# Altium schematic sheet Paddle_2.SchDoc: Paddle 2
size A4
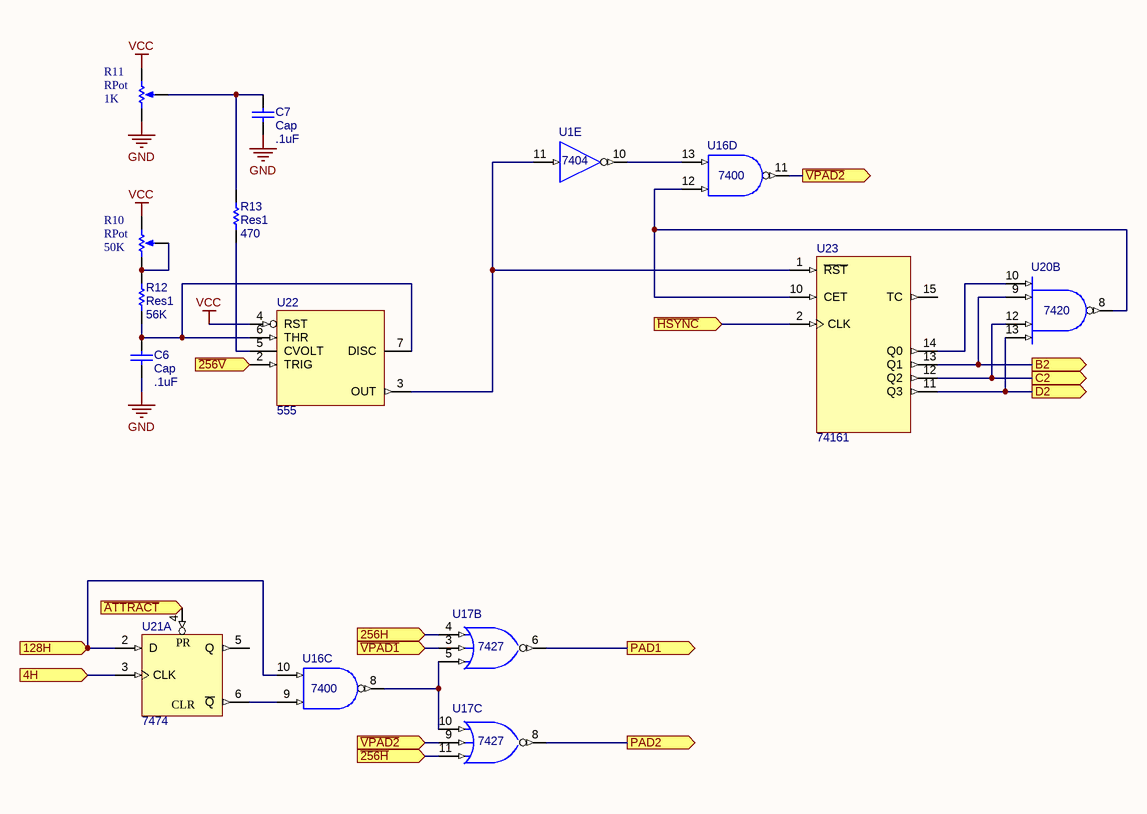
[diagram p0: Paddle_2.SchDoc]

## Parts
C6  Cap  value .1uF  [CAPR10.16-11.5x3.6]
C7  Cap  value .1uF  [CAPR10.16-11.5x3.6]
R10  RPot  value 50K  [TRIMPOT_THT_PV36X]
R11  RPot  value 1K  [VR5]
R12  Res1  value 56K  [AXIAL-0.4]
R13  Res1  value 470  [AXIAL-0.4]
U1  7404  [N014]  (part E of 6)
U16  7400  [N014]  (parts C,D of 4)
U17  7427  [N014]  (parts B,C of 3)
U20  7420  [N014]  (part B of 2)
U21  7474  [N014D]  (part A of 2)
U22  555  [P008]
U23  74161  [N016]

## Ports
4H, 128H, 256H, B2, C2, D2, PAD1, PAD2, ~{256H}, ~{256V}, ~{ATTRACT}, ~{HSYNC}, ~{VPAD1}, ~{VPAD2}

## Nets
GND: C6.1 C7.1 R11.1(TOP) U1.7(GND) U16.7(GND) U17.7(GND) U20.7(GND) U21.7(GND) U22.1(GND) U23.8(GND)
VCC: R10.CW(BOT) R11.2(BOT) U1.14(VCC) U16.14(VCC) U17.14(VCC) U20.14(VCC) U21.1(CLR) U21.14(VCC) U22.4(RST) U22.8(VCC) U23.3(P0) U23.4(P1) U23.5(P2) U23.6(P3) U23.7(CEP) U23.9(~{PE}) U23.16(VCC)
4H: U21.3(CLK) ; port 4H
128H: U16.10(B) U21.2(D) ; port 128H
256H: U17.4(B) ; port 256H
~{256H}: U17.11(C) ; port ~{256H}
~{256V}: U22.2(TRIG) ; port ~{256V}
~{ATTRACT}: U21.4(PR) ; port ~{ATTRACT}
~{HSYNC}: U23.2(CLK) ; port ~{HSYNC}
~{VPAD1}: U17.3(A) ; port ~{VPAD1}
~{VPAD2}: U16.11(Y) U17.9(A) ; port ~{VPAD2}
B2: U20.9(A) U23.13(Q1) ; port B2
C2: U20.12(C) U23.12(Q2) ; port C2
D2: U20.13(D) U23.11(Q3) ; port D2
PAD1: U17.6(Y) ; port PAD1
PAD2: U17.8(Y) ; port PAD2
NetC6_2: C6.2 R12.1 U22.6(THR) U22.7(DISC)
NetC7_2: C7.2 R11.3(TAP) R13.2
NetR10_CCW: R10.CCW(TOP) R10.W(TAP) R12.2
NetR13_1: R13.1 U22.5(CVOLT)
NetU1_10: U1.10(Y) U16.13(B)
NetU1_11: U1.11(A) U22.3(OUT) U23.1(~{RST})
NetU16_8: U16.8(Y) U17.5(C) U17.10(B)
NetU16_9: U16.9(A) U21.6(~{Q})
NetU16_12: U16.12(A) U20.8(Y) U23.10(CET)
NetU20_10: U20.10(B) U23.14(Q0)

Not connected (* = marked no-connect by the designer): U21 5(Q); U23 15(TC)

## Notes on the sheet
- Text
- Page
- PONG

## Library data of the parts
C6 C7 = Cap: Capacitor; Published: 8-Jun-2000; LatestRevisionDate: 17-Jul-2002; LatestRevisionNote: Re-released for DXP Platform.; PackageReference: RAD-0.3; Publisher: Altium Limited; PackageDescription: Radial Cap, Thru-Hole; 2 Leads; 0.3 in Pin Spacing
R10 R11 = RPot: Potentiometer; Sim Note: Enter the Resistance value and the set point into parameter fields.; Set Position: 0.5; Published: 8-Jun-2000; LatestRevisionDate: 17-Jul-2002; LatestRevisionNote: Re-released for DXP Platform.; PackageReference: VR5; Publisher: Altium Limited; PackageDescription: Variable Resistor, Thru-Hole; 3 Leads
R12 R13 = Res1: Resistor; Published: 8-Jun-2000; LatestRevisionDate: 17-Jul-2002; LatestRevisionNote: Re-released for DXP Platform.; PackageReference: AXIAL-0.3; Publisher: Altium Limited; PackageDescription: Axial Device, Thru-Hole; 2 Leads; 0.3 in Pin Spacing
U1 = SN74LS04N: Hex Inverter; Published: 8-Jun-2000; LatestRevisionDate: 04-Mar-2005; LatestRevisionNote: Stylized 3D Model Added.; DatasheetVersion: Mar-1988; PackageVersion: Oct-1995; PackageReference: N014; Publisher: Altium Limited; PackageDescription: DIP; 14 Leads; Row Spacing 7.62 mm; Pitch 2.54 mm; ComponentLink1Description: Manufacturer Link; ComponentLink1URL: http://www.ti.com/; ComponentLink2Description: Datasheet; ComponentLink2URL: http://www-s.ti.com/sc/ds/sn74ls04.pdf
U16 = SN74LS00N: Quadruple 2-Input Positive-NAND Gate; Published: 8-Jun-2000; LatestRevisionDate: 04-Mar-2005; LatestRevisionNote: Stylized 3D Model Added.; DatasheetVersion: Mar-1988; PackageVersion: Oct-1995; PackageReference: N014; Publisher: Altium Limited; PackageDescription: DIP; 14 Leads; Row Spacing 7.62 mm; Pitch 2.54 mm; ComponentLink1Description: Manufacturer Link; ComponentLink1URL: http://www.ti.com/; ComponentLink2Description: Datasheet; ComponentLink2URL: http://www-s.ti.com/sc/ds/sn74ls00.pdf
U17 = SN74LS27N: Triple 3-Input Positive-NOR Gate; Published: 8-Jun-2000; LatestRevisionDate: 04-Mar-2005; LatestRevisionNote: Stylized 3D Model Added.; DatasheetVersion: Mar-1988; PackageVersion: Oct-1995; PackageReference: N014; Publisher: Altium Limited; PackageDescription: DIP; 14 Leads; Row Spacing 7.62 mm; Pitch 2.54 mm; ComponentLink1Description: Manufacturer Link; ComponentLink1URL: http://www.ti.com/; ComponentLink2Description: Datasheet; ComponentLink2URL: http://www-s.ti.com/sc/ds/sn74ls27.pdf
U20 = SN74LS20N: Dual 4-Input Positive-NAND Gate; Note: Pins 3 and 11 are NC & not drawn.; Published: 8-Jun-2000; LatestRevisionDate: 04-Mar-2005; LatestRevisionNote: Stylized 3D Model Added.; DatasheetVersion: Mar-1988; PackageVersion: Oct-1995; PackageReference: N014; Publisher: Altium Limited; PackageDescription: DIP; 14 Leads; Row Spacing 7.62 mm; Pitch 2.54 mm; ComponentLink1Description: Manufacturer Link; ComponentLink1URL: http://www.ti.com/; ComponentLink2Description: Datasheet; ComponentLink2URL: http://www-s.ti.com/sc/ds/sn74ls20.pdf
U21 = SN74LS74AN: Dual D-Type Positive-Edge-Triggered Flip-Flop with Preset and Clear; Published: 8-Jun-2000; LatestRevisionDate: 04-Mar-2005; LatestRevisionNote: Stylized 3D Model Added.; DatasheetVersion: Mar-1988; PackageVersion: Oct-1995; PackageReference: N014D; Publisher: Altium Limited; PackageDescription: DIP; 14 Leads; Row Spacing 7.62 mm; Pitch 2.54 mm; ComponentLink1Description: Manufacturer Link; ComponentLink1URL: http://www.ti.com/; ComponentLink2Description: Datasheet; ComponentLink2URL: http://www-s.ti.com/sc/ds/sn74ls74a.pdf
U22 = NE555P: Precision Timer; Published: 16-Jan-2001; LatestRevisionDate: 04-Mar-2005; LatestRevisionNote: Stylized 3D Model Added.; DatasheetVersion: Feb-1992; PackageVersion: Jun-1999; PackageReference: P008; Publisher: Altium Limited; PackageDescription: DIP; 8 Leads; Row Spacing 7.62 mm; Pitch 2.54 mm; Code_JEDEC: MO-001-AN; ComponentLink1Description: Manufacturer Link; ComponentLink1URL: http://www.ti.com/; ComponentLink2Description: Datasheet; ComponentLink2URL: http://www-s.ti.com/sc/ds/ne555.pdf
U23 = SN74LS161AN: Synchronous 4-Bit Counter; Published: 8-Jun-2000; LatestRevisionDate: 04-Mar-2005; LatestRevisionNote: Stylized 3D Model Added.; DatasheetVersion: Mar-1988; PackageVersion: Oct-1995; PackageReference: N016; Publisher: Altium Limited; PackageDescription: DIP; 16 Leads; Row Spacing 7.62 mm; Pitch 2.54 mm; Code_JEDEC: MS-001-BB; ComponentLink1Description: Manufacturer Link; ComponentLink1URL: http://www.ti.com/; ComponentLink2Description: Datasheet; ComponentLink2URL: http://www-s.ti.com/sc/ds/sn74ls161a.pdf; ComponentLink3Description: URL Link1; ComponentLink3URL: http://focus.ti.com/docs/prod/folders/print/sn74ls161a.html